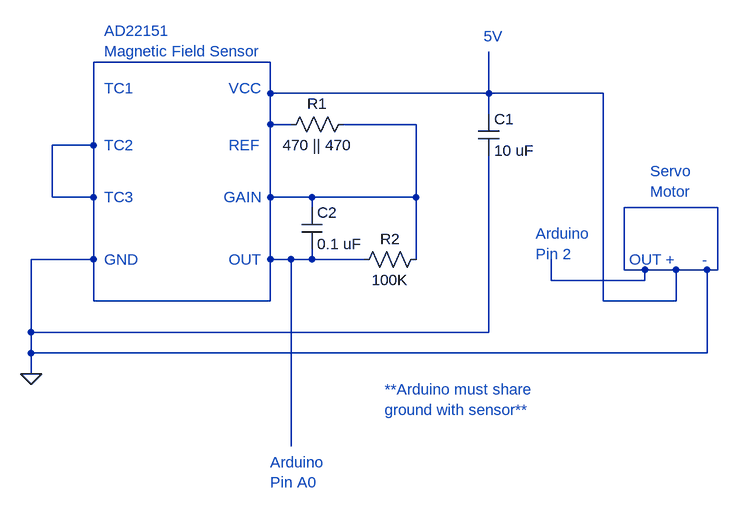
[diagram p0: schematic IEEE-Magnetic-Field-Sensor.asc]
IEEE-Magnetic-Field-Sensor.asc, the LTspice schematic file:
Version 4
SHEET 1 1020 680
WIRE 64 0 -208 0
WIRE 64 48 64 0
WIRE 400 48 400 -16
WIRE 400 48 64 48
WIRE 576 48 400 48
WIRE 400 80 400 48
WIRE 64 96 64 48
WIRE 96 96 64 96
WIRE 288 96 176 96
WIRE -208 128 -208 0
WIRE -208 128 -272 128
WIRE -272 208 -272 128
WIRE -208 208 -208 128
WIRE -208 208 -272 208
WIRE 64 208 64 96
WIRE 128 208 64 208
WIRE 288 208 288 96
WIRE 288 208 128 208
WIRE 128 224 128 208
WIRE 752 224 608 224
WIRE -208 304 -208 208
WIRE -208 304 -304 304
WIRE 64 304 64 208
WIRE 96 304 64 304
WIRE 128 304 128 288
WIRE 128 304 96 304
WIRE 208 304 128 304
WIRE 288 304 288 208
WIRE 608 320 608 224
WIRE 640 320 608 320
WIRE 688 320 640 320
WIRE 736 320 688 320
WIRE 752 320 752 224
WIRE 752 320 736 320
WIRE 496 336 496 304
WIRE 640 336 640 320
WIRE 640 336 496 336
WIRE -208 368 -208 304
WIRE 64 368 64 304
WIRE 64 368 -208 368
WIRE 576 368 576 48
WIRE 688 368 688 320
WIRE 688 368 576 368
WIRE -304 416 -304 304
WIRE 400 416 400 144
WIRE 400 416 -304 416
WIRE -304 448 -304 416
WIRE 736 448 736 320
WIRE 736 448 -304 448
WIRE -304 480 -304 448
WIRE 96 592 96 304
FLAG -304 480 0
SYMBOL res 192 80 R90
WINDOW 0 0 56 VBottom 2
WINDOW 3 32 56 VTop 2
SYMATTR InstName R1
SYMATTR Value 470 || 470
SYMBOL res 304 288 R90
WINDOW 0 0 56 VBottom 2
WINDOW 3 32 56 VTop 2
SYMATTR InstName R2
SYMATTR Value 100K
SYMBOL cap 112 224 R0
SYMATTR InstName C2
SYMATTR Value 0.1 uF
SYMBOL cap 384 80 R0
SYMATTR InstName C1
SYMATTR Value 10 uF
TEXT -192 40 Left 2 ;TC1
TEXT 0 40 Left 2 ;VCC
TEXT -192 128 Left 2 ;TC2
TEXT -192 208 Left 2 ;TC3
TEXT -192 304 Left 2 ;GND
TEXT 0 128 Left 2 ;REF
TEXT -8 208 Left 2 ;GAIN
TEXT 0 304 Left 2 ;OUT
TEXT 392 -40 Left 2 ;5V
TEXT 64 616 Left 2 ;Arduino\nPin A0
TEXT 672 304 Left 2 ;+
TEXT 728 304 Left 2 ;-
TEXT 616 304 Left 2 ;OUT
TEXT 472 264 Left 2 ;Arduino\nPin 2
TEXT 648 168 Left 2 ;Servo\nMotor
TEXT -192 -48 Left 2 ;AD22151\nMagnetic Field Sensor
TEXT 240 504 Left 2 ;**Arduino must share \nground with sensor**

The netlist it stands for:
* IEEE-Magnetic-Field-Sensor.asc
R1 0 0 470 || 470
R2 0 0 100K
C2 0 0 0.1 uF
C1 0 0 10 uF
* TC1
* VCC
* TC2
* TC3
* GND
* REF
* GAIN
* OUT
* 5V
* Arduino
* Pin A0
* +
* -
* OUT
* Arduino
* Pin 2
* Servo
* Motor
* AD22151
* Magnetic Field Sensor
* **Arduino must share
* ground with sensor**
.backanno
.end